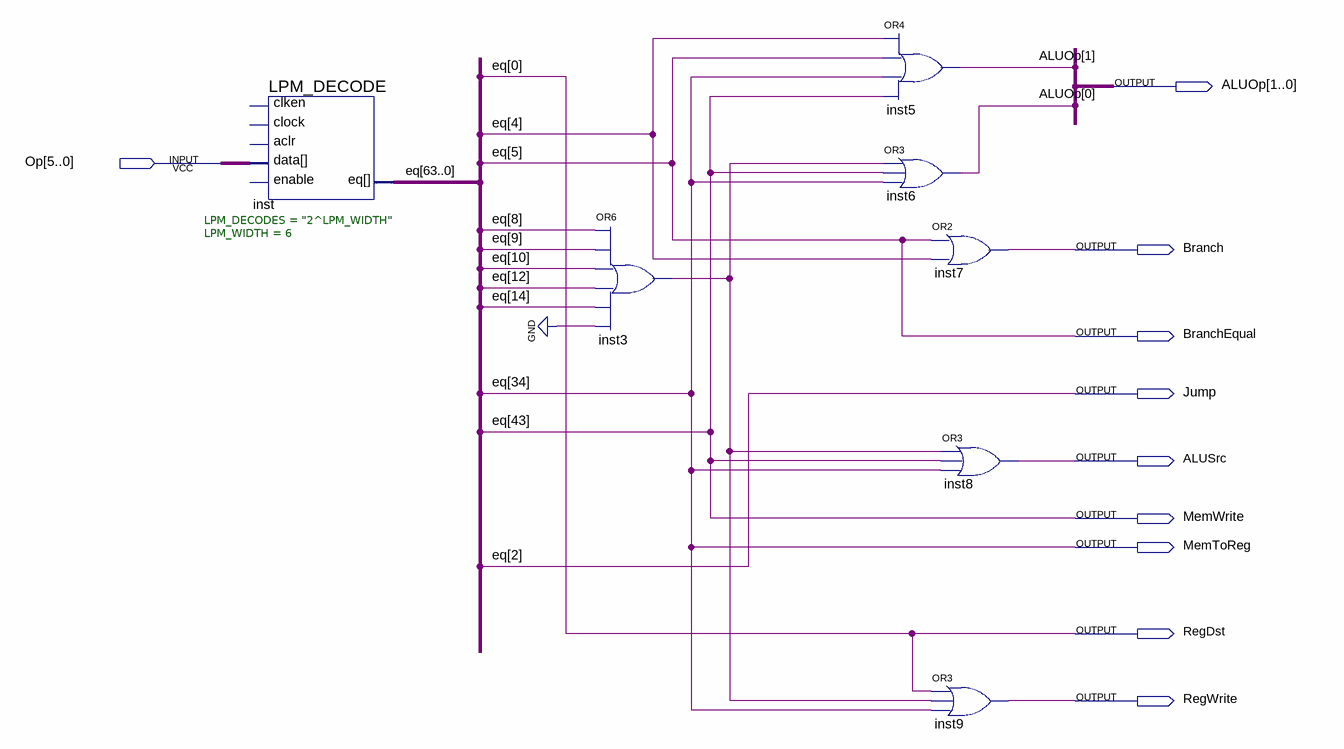
[diagram p0: schematic sheet]
// Quartus schematic ControlUnit.bdf as structural Verilog: 7 symbols, 10 pins
module ControlUnit (
  input  [5:0] Op,
  output [1:0] ALUOp,
  output Branch,
  output BranchEqual,
  output Jump,
  output ALUSrc,
  output MemWrite,
  output MemToReg,
  output RegDst,
  output RegWrite
);

  wire inst3_out;
  wire [63:1] eq;

  LPM_DECODE #(.LPM_DECODES("2^LPM_WIDTH"), .LPM_WIDTH(6)) inst (
    .data(Op),
    .eq({eq[63:44], MemWrite, eq[42:35], MemToReg, eq[33:6], BranchEqual, eq[4:3], Jump, eq[1], RegDst}));  // open: enable, clken, clock, aclr
  or inst3 (inst3_out, eq[8], eq[9], eq[10], eq[12], eq[14], 1'b0);
  or inst5 (ALUOp[1], eq[4], BranchEqual, MemToReg, MemWrite);
  or inst6 (ALUOp[0], inst3_out, MemWrite, MemToReg);
  or inst7 (Branch, BranchEqual, eq[4]);
  or inst8 (ALUSrc, inst3_out, MemWrite, MemToReg);
  or inst9 (RegWrite, RegDst, inst3_out, MemToReg);

  // Other names for the same wires on the sheet: eq (some bits) = {MemWrite, MemToReg, BranchEqual, Jump, RegDst}
endmodule
